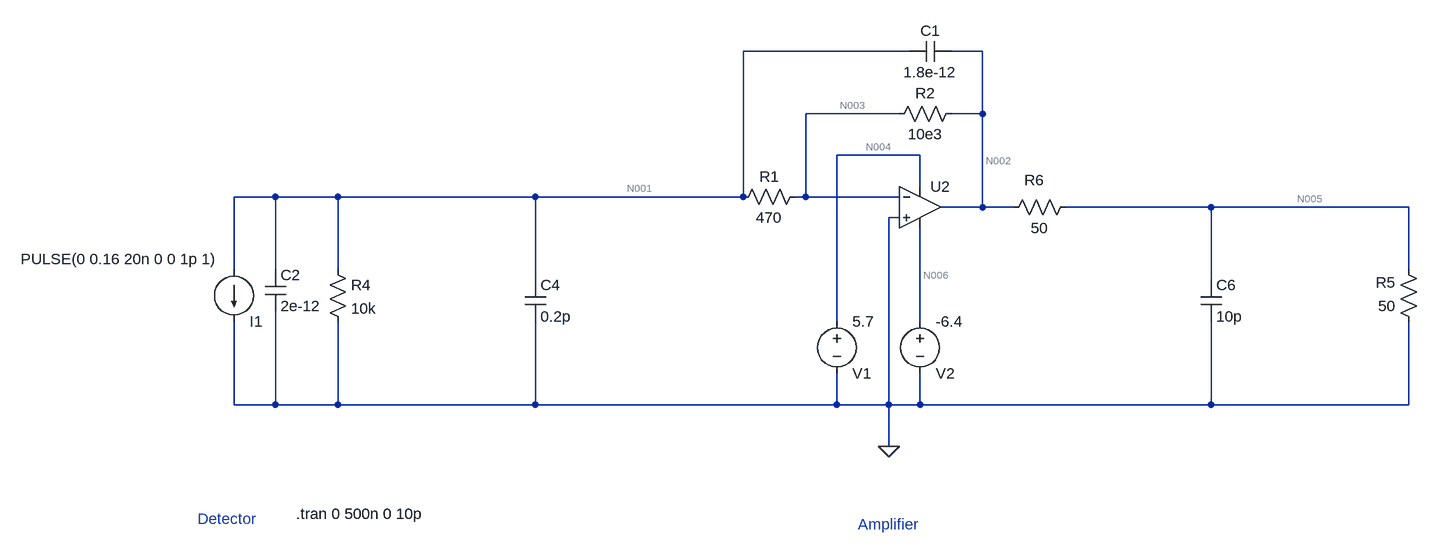
[diagram p0: schematic Draft2.asc]
Draft2.asc, the LTspice schematic file:
Version 4
SHEET 1 2308 680
WIRE -1488 -2176 -1744 -2176
WIRE -1376 -2176 -1424 -2176
WIRE -1504 -2080 -1648 -2080
WIRE -1376 -2080 -1376 -2176
WIRE -1376 -2080 -1424 -2080
WIRE -1472 -2016 -1600 -2016
WIRE -1472 -1968 -1472 -2016
WIRE -2464 -1952 -2528 -1952
WIRE -2368 -1952 -2464 -1952
WIRE -2064 -1952 -2368 -1952
WIRE -1744 -1952 -1744 -2176
WIRE -1744 -1952 -2064 -1952
WIRE -1648 -1952 -1648 -2080
WIRE -1648 -1952 -1664 -1952
WIRE -1504 -1952 -1648 -1952
WIRE -1376 -1936 -1376 -2080
WIRE -1376 -1936 -1440 -1936
WIRE -1328 -1936 -1376 -1936
WIRE -1024 -1936 -1248 -1936
WIRE -720 -1936 -1024 -1936
WIRE -1504 -1920 -1520 -1920
WIRE -2528 -1840 -2528 -1952
WIRE -2464 -1840 -2464 -1952
WIRE -2368 -1840 -2368 -1952
WIRE -720 -1840 -720 -1936
WIRE -2064 -1824 -2064 -1952
WIRE -1024 -1824 -1024 -1936
WIRE -1600 -1760 -1600 -2016
WIRE -1472 -1760 -1472 -1904
WIRE -2528 -1632 -2528 -1760
WIRE -2464 -1632 -2464 -1776
WIRE -2464 -1632 -2528 -1632
WIRE -2368 -1632 -2368 -1760
WIRE -2368 -1632 -2464 -1632
WIRE -2064 -1632 -2064 -1760
WIRE -2064 -1632 -2368 -1632
WIRE -1600 -1632 -1600 -1680
WIRE -1600 -1632 -2064 -1632
WIRE -1520 -1632 -1520 -1920
WIRE -1520 -1632 -1600 -1632
WIRE -1472 -1632 -1472 -1680
WIRE -1472 -1632 -1520 -1632
WIRE -1024 -1632 -1024 -1760
WIRE -1024 -1632 -1472 -1632
WIRE -720 -1632 -720 -1760
WIRE -720 -1632 -1024 -1632
WIRE -1520 -1568 -1520 -1632
FLAG -1520 -1568 0
SYMBOL res -1648 -1968 R90
WINDOW 0 0 56 VBottom 2
WINDOW 3 32 56 VTop 2
SYMATTR InstName R1
SYMATTR Value 470
SYMBOL res -1520 -2064 R270
WINDOW 0 32 56 VTop 2
WINDOW 3 0 56 VBottom 2
SYMATTR InstName R2
SYMATTR Value 10e3
SYMBOL cap -1488 -2160 R270
WINDOW 0 32 32 VTop 2
WINDOW 3 0 32 VBottom 2
SYMATTR InstName C1
SYMATTR Value 1.8e-12
SYMBOL cap -2480 -1840 R0
SYMATTR InstName C2
SYMATTR Value 2e-12
SYMBOL voltage -1600 -1776 R0
WINDOW 0 24 96 Left 2
WINDOW 3 24 16 Left 2
WINDOW 123 0 0 Left 2
WINDOW 39 0 0 Left 2
SYMATTR InstName V1
SYMATTR Value 5.7
SYMBOL current -2528 -1840 R0
WINDOW 0 24 80 Left 2
WINDOW 3 -328 -16 Left 2
WINDOW 123 0 0 Left 2
WINDOW 39 0 0 Left 2
SYMATTR InstName I1
SYMATTR Value PULSE(0 0.16 20n 0 0 1p 1)
SYMBOL voltage -1472 -1776 R0
WINDOW 0 24 96 Left 2
WINDOW 3 24 16 Left 2
WINDOW 123 0 0 Left 2
WINDOW 39 0 0 Left 2
SYMATTR InstName V2
SYMATTR Value -6.4
SYMBOL res -704 -1744 R180
WINDOW 0 36 76 Left 2
WINDOW 3 36 40 Left 2
SYMATTR InstName R5
SYMATTR Value 50
SYMBOL res -1344 -1920 R270
WINDOW 0 42 48 VTop 2
WINDOW 3 0 56 VBottom 2
SYMATTR InstName R6
SYMATTR Value 50
SYMBOL cap -2080 -1824 R0
SYMATTR InstName C4
SYMATTR Value 0.2p
SYMBOL res -2384 -1856 R0
SYMATTR InstName R4
SYMATTR Value 10k
SYMBOL Opamps\\UniversalOpamp2 -1472 -1936 R0
SYMATTR InstName U2
SYMBOL cap -1040 -1824 R0
SYMATTR InstName C6
SYMATTR Value 10p
TEXT -2432 -1464 Left 2 !.tran 0 500n 0 10p
TEXT -2584 -1456 Left 2 ;Detector
TEXT -1568 -1448 Left 2 ;Amplifier

The netlist it stands for:
* Draft2.asc
R1 N003 N001 470
R2 N003 N002 10e3
C1 N001 N002 1.8e-12
C2 N001 0 2e-12
V1 N004 0 5.7
I1 N001 0 PULSE(0 0.16 20n 0 0 1p 1)
V2 N006 0 -6.4
R5 0 N005 50
R6 N002 N005 50
C4 N001 0 0.2p
R4 N001 0 10k
XU2 0 N003 N004 N006 N002 level.2 Avol=1Meg GBW=10Meg Slew=10Meg ilimit=25m rail=0 Vos=0 phimargin=45 en=0 enk=0 in=0 ink=0 Rin=500Meg  ; pins IN+ IN- V+ V- OUT
C6 N005 0 10p
.tran 0 500n 0 10p
* Detector
* Amplifier
.lib UniversalOpamps2.sub
.backanno
.end

* Results of the author's LTspice run, read from the files saved beside the schematic
* Operating Point, zero values left out:
*   V(n003) = -351.3 nV
*   V(n001) = -335.6 nV
*   V(n002) = 6.313 µV
*   V(n004) = 5.7 V
*   V(n006) = -6.4 V
*   V(n005) = 3.157 µV
*   I(R4) = -33.56 pA
*   I(R6) = 63.13 nA
*   I(R5) = -63.13 nA
*   I(R2) = -666.4 pA
*   I(R1) = -33.56 pA
*   I(V2) = 603.9 µA
*   I(V1) = -603.9 µA
*   Ix(u2:1) = 700 pA
*   Ix(u2:2) = 700 pA
*   Ix(u2:3) = 603.9 µA
*   Ix(u2:4) = -603.9 µA
*   Ix(u2:5) = -63.8 nA
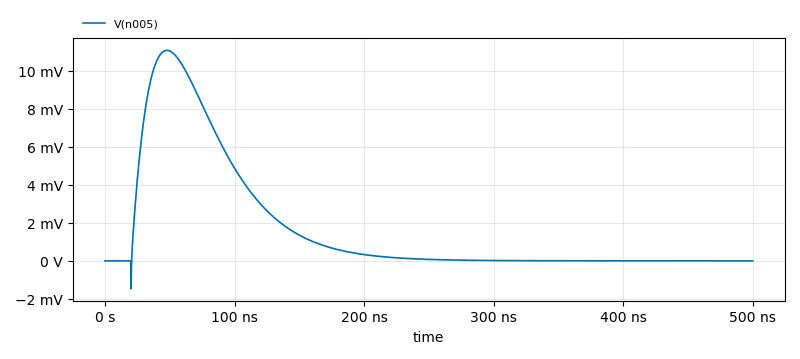
[diagram p1: Transient Analysis of Draft2.asc, plotted from the saved traces]
* Transient Analysis, 1 run:
*   V(n005): min -1.464 mV, max 11.06 mV, average 1.676 mV, rms 3.538 mV, last 3.199 µV